# Altium schematic sheet PowerConnector.SchDoc
size A; SheetNumber: 11; SheetTotal: 11
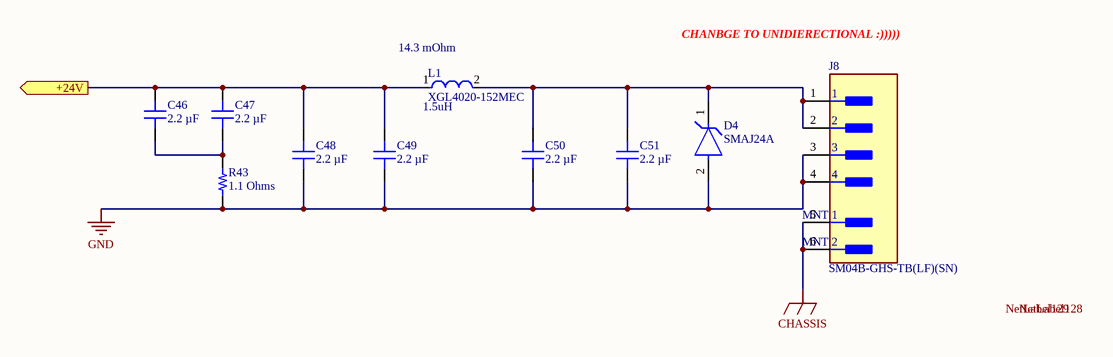
[diagram p0: PowerConnector.SchDoc]

## Parts
C46  2.2 µF  [CAP 0805_2012]
C47  2.2 µF  [CAP 0805_2012]
C48  2.2 µF  [CAP 0805_2012]
C49  2.2 µF  [CAP 0805_2012]
C50  2.2 µF  [CAP 0805_2012]
C51  2.2 µF  [CAP 0805_2012]
D4  SMAJ24A  [FP-SMAJ-MFG]
J8  SM04B-GHS-TB(LF)(SN)  [FP-SM04B-GHS-TB_LF_SN-MFG]
L1  XGL4020-152MEC  value 1.5uH  [FP-XGL4020-MFG]
R43  1.1 Ohms  [RES 0603_1608]

## Ports
+24V (out)

## Nets
CHASSIS: J8.5(MNT_1) J8.6(MNT_2)
GND: C48.1 C49.1 C50.1 C51.1 D4.2(A) J8.3 J8.4 R43.1
+24V: C46.2 C47.2 C48.2 C49.2 L1.1 ; port +24V
NetC46_1: C46.1 C47.1 R43.2
NetC50_2: C50.2 C51.2 D4.1(C) J8.1 J8.2 L1.2

## Notes on the sheet
- (near L1) 14.3 mOhm
- CHANBGE TO UNIDIERECTIONAL :)))))
- Labels drawn without touching a wire or pin: NetLabel128, NetLabel129

## Library data of the parts
C46-C51 = CGA4J3X5R1H225K125AB: CAP CER 2.2UF 50V X5R 0805; manufacturer: TDK Corporation; Tolerance: ±10%; Part Number: CGA4J3X5R1H225K125AB; Capacitance: 2.2 µF; Applications: Automotive; componentlink1description: Datasheet; componentlink1url: https://product.tdk.com/info/en/catalog/datasheets/mlcc_automotive_general_en.pdf?ref_disty=digikey; componentlink2description: DigiKey Link; componentlink2url: https://www.digikey.com/en/products/detail/tdk-corporation/CGA4J3X5R1H225K125AB/2781306; Device Package: 0805 (2012 Metric); lastupdated: 2/9/2024 8:15:32 PM; Lifecycle Status: Active; Minimum Order: 1; Mounting Type: Surface Mount, MLCC; Operating Temperature: -55°C ~ 85°C; Package / Case: 0805 (2012 Metric); packaging: TapeAndReel; partid: 44302; Part Status: Active; price: 0.11; Ratings: AEC-Q200; series: CGA; Size / Dimension: 0.079" L x 0.049" W (2.00mm x 1.25mm); Supplier 1: DigiKey; Supplier Part Number 1: 445-7880-1-ND; Temperature Coefficient: X5R; Thickness (Max): 0.057" (1.45mm); value: 2.2 µF; Voltage - Rated: 50V
D4 = CMP-08607-000085-1: TVS DIODE 24V 38.9V DO214AC; Manufacturer: Littelfuse Inc; Direction: Unidirectional; Peak Pulse Power: 400W; Peak Pulse Current: 10.3A; Max Junction Temp: +150°C; Breakdown Voltage: 26.7V; Number Of Channels: 1; ComponentLink2Description: Datasheet; Device Class L3: unset; Height: 2.29mm; ComponentLink2URL: https://www.littelfuse.com/~/media/electronics/datasheets/tvs_diodes/littelfuse_tvs_diode_smaj_datasheet.pdf.pdf; Device Class L1: Circuit Protection; Package: SMAJ; Temperature Range High: +150°C; Device Class L2: TVS Diodes; Clamping Voltage: 38.9V; Reverse Standoff Voltage: 24V; Manufacturer Part Number: SMAJ24A; Mouser Description: In a Pack of 25, Littelfuse SMAJ24A, Uni-Directional TVS Diode, 400W, 2-Pin DO-214AC; Digikey Description: TVS DIODE 24V 38.9V DO214AC; Lead Free: Yes; Octopart: https://octopart.com/smaj24a-littelfuse-350003; Automotive: No; Temperature Range Low: -65°C; Category: Diode; RoHS: TRUE; Temperature: -65°C to +150°C
J8 = CMP-17439-000411-1: CONN HEADER SMD R/A 4POS 1.25MM; Voltage Rating: 50V; Number of Contacts: 4; Current Rating: 1A; Termination: Solder; Mount: Surface Mount; REACH SVHC: No SVHC; Packaging: Cut Tape; Contact Material: Bronze; Series: GH; Orientation: Right Angle; Lead Free: Lead Free; Housing Material: Nylon; Contact Plating: Tin; Housing Color: Natural; Number of Rows: 1; Pitch: 1.25mm; Number of Positions: 4
L1 = CMP-11268-000020-1: Shielded Power Inductors; Manufacturer: Coilcraft; Saturation Current: 3.2A; Rms Current: 11.1A; Standoff Height: 0.12mm; Self Resonant Frequency: 45MHz; Series Resistance: 14.3mΩ; Test Frequency: 1MHz; Automotive Grade: Grade 1; Tolerance: 20%; Shielding: true; Core Material: Wirewound; ComponentLink2Description: Datasheet; Device Class L3: Fixed Inductors; Category: Ind; Device Class L2: Inductors; Inductance: 1.5uH; Package: XGL4020; Automotive: Yes; Ambient Temperature Range Low: -40°C; Manufacturer Part Number: XGL4020-152MEC; ComponentLink2URL: https://www.coilcraft.com/pdfs/xgl4020.pdf; Lead Free: Yes; RoHS: TRUE; Height: 2.1mm; Device Class L1: Passive Components; Composition: Composite; Ambient Temperature Range High: +125°C; Octopart: https://octopart.com/xgl4020-152mec-coilcraft-99681026
R43 = SR731JRTTD1R10F: RES 1.1 OHM 1% 1/5W 0603; Manufacturer: KOA Speer Electronics, Inc.; Power (Watts): 0.2W, 1/5W; Temperature Coefficient: ±200ppm/°C; Part Number: SR731JRTTD1R10F; Value: 1.1 Ohms; ComponentLink1Description: Datasheet; ComponentLink1URL: https://www.koaspeer.com/pdfs/SR73-RT.pdf; ComponentLink2Description: DigiKey Link; ComponentLink2URL: https://www.digikey.com/en/products/detail/koa-speer-electronics-inc/SR731JRTTD1R10F/13426422; Composition: Thick Film; Device Package: 0603 (1608 Metric); Features: Anti-Sulfur, Automotive AEC-Q200, Current Sense, Moisture Resistant; Height - Seated (Max): 0.022" (0.55mm); LastUpdated: 2/9/2024 8:41:12 PM; Lifecycle Status: Active; Minimum Order: 1; Number of Terminations: 2; Operating Temperature: -55°C ~ 155°C; Package / Case: 0603 (1608 Metric); Packaging: TapeAndReel; PartId: 67152; Part Status: Active; Price: 0.09; Ratings: AEC-Q200; Resistance: 1.1 Ohms; Series: SR73-RT; Size / Dimension: 0.063" L x 0.031" W (1.60mm x 0.80mm); Supplier 1: DigiKey; Supplier Part Number 1: 2019-SR731JRTTD1R10FCT-ND; Supplier Device Package: 0603; Tolerance: ±1%